# EAGLE design placa_v1 (EAGLE 7.2.0)
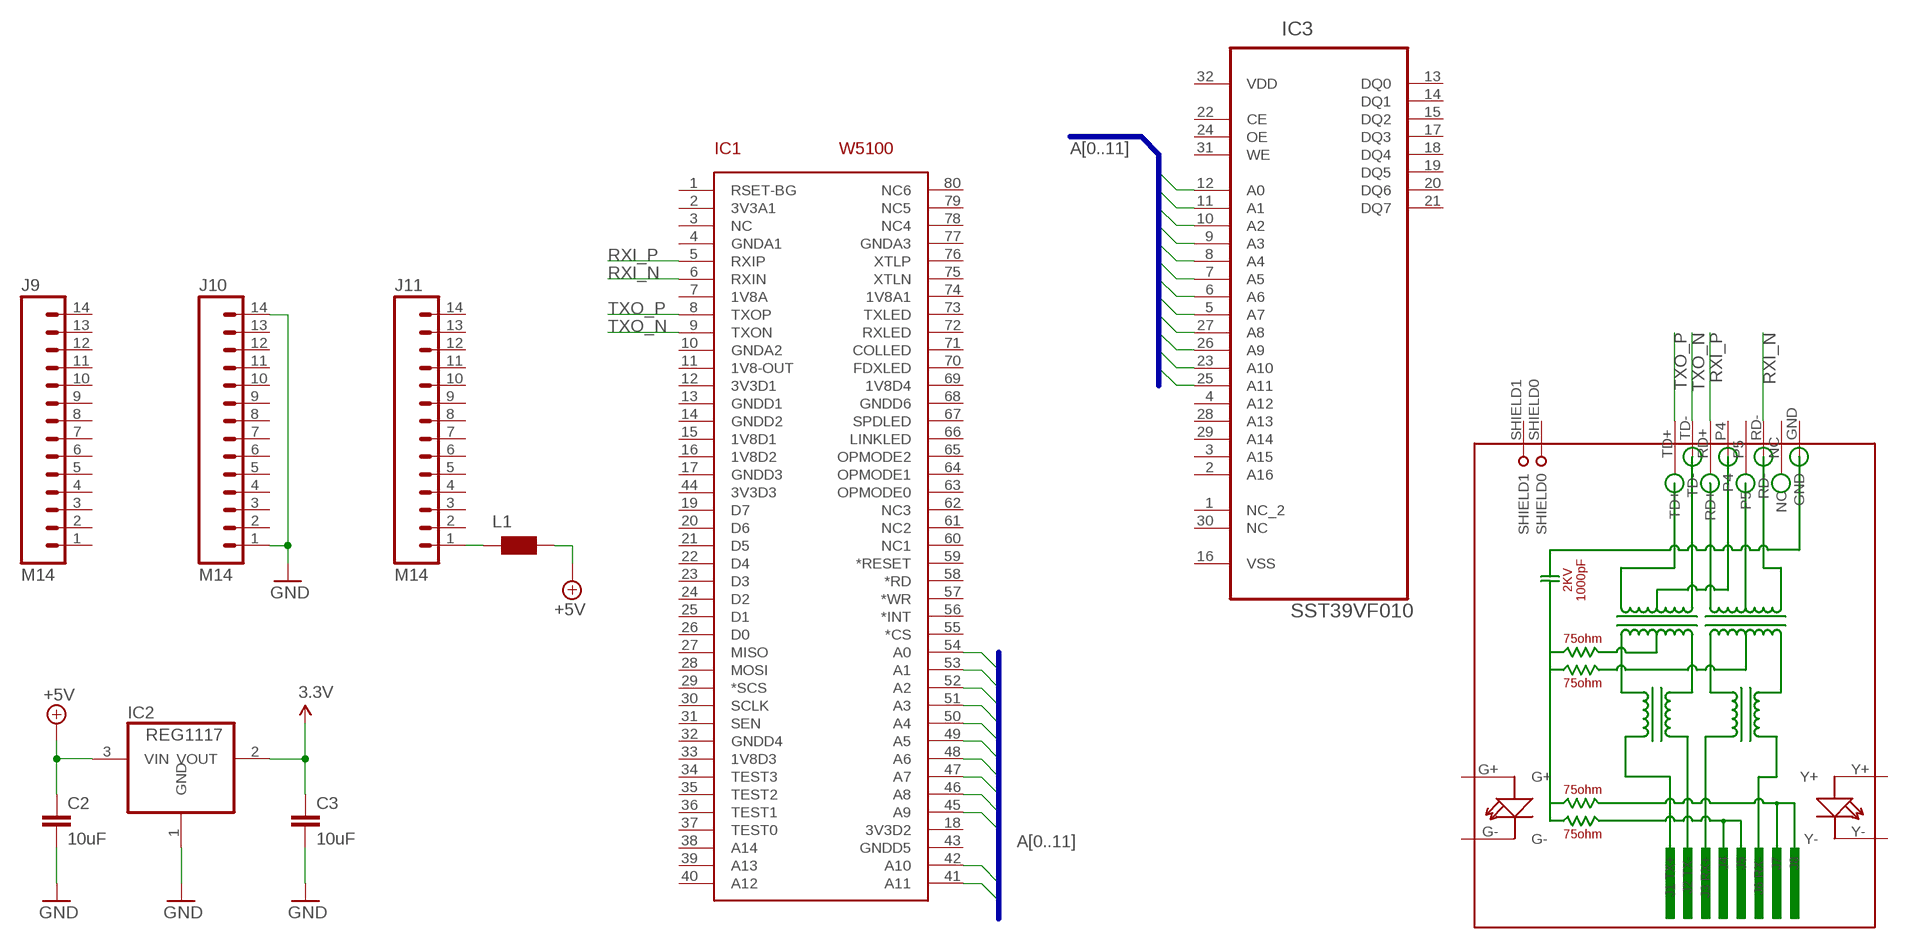
[diagram p0: schematic, sheet 1]

## Parts
C2  10uF  C-EUC0805K  [C0805K]
C3  10uF  C-EUC0805K  [C0805K]
IC1  W5100  [SQFP-S-10X10-80]
IC2  REG1117  [SOT223]
IC3  SST39VF010  SST39VF010-70-4I-NHE  [PLCC127P1244X1498X357-32N]
J9  M14  [1X14]
J10  M14  [1X14]
J11  M14  [1X14]
L1  WE-CBF_0805  [0805]
RJ1  HR911105A  [HR911105A]

## Nets
3.3V [power]: C3.1 IC2.2(VOUT)
+5V [power]: C2.1 IC2.3(VIN) L1.2
A0: IC1.54(A0) IC3.12(A0)
A1: IC1.53(A1) IC3.11(A1)
A2: IC1.52(A2) IC3.10(A2)
A3: IC1.51(A3) IC3.9(A3)
A4: IC1.50(A4) IC3.8(A4)
A5: IC1.49(A5) IC3.7(A5)
A6: IC1.48(A6) IC3.6(A6)
A7: IC1.47(A7) IC3.5(A7)
A8: IC1.46(A8) IC3.27(A8)
A9: IC1.45(A9) IC3.26(A9)
A10: IC1.42(A10) IC3.23(A10)
A11: IC1.41(A11) IC3.25(A11)
GND [power]: C2.2 C3.2 IC2.1(GND) J10.1 J10.14
N$1 [power]: J11.1 L1.1
RXI_N [rx]: IC1.6(RXIN) RJ1.RD-
RXI_P [rx]: IC1.5(RXIP) RJ1.RD+
TXO_N [tx]: IC1.9(TXON) RJ1.TD-
TXO_P [tx]: IC1.8(TXOP) RJ1.TD+
Unconnected: IC1.1(RSET-BG) IC1.3(NC) IC1.19(D7) IC1.20(D6) IC1.21(D5) IC1.22(D4) IC1.23(D3) IC1.24(D2) IC1.25(D1) IC1.26(D0) IC1.27(MISO) IC1.28(MOSI) IC1.29(*SCS) IC1.30(SCLK) IC1.31(SEN) IC1.34(TEST3) IC1.35(TEST2) IC1.36(TEST1) IC1.37(TEST0) IC1.38(A14) IC1.39(A13) IC1.40(A12) IC1.55(*CS) IC1.56(*INT) IC1.57(*WR) IC1.58(*RD) IC1.59(*RESET) IC1.60(NC1) IC1.61(NC2) IC1.62(NC3) IC1.63(OPMODE0) IC1.64(OPMODE1) IC1.65(OPMODE2) IC1.66(LINKLED) IC1.67(SPDLED) IC1.70(FDXLED) IC1.71(COLLED) IC1.72(RXLED) IC1.73(TXLED) IC1.75(XTLN) IC1.76(XTLP) IC1.78(NC4) IC1.79(NC5) IC1.80(NC6) IC3.1(NC_2) IC3.2(A16) IC3.3(A15) IC3.4(A12) IC3.13(DQ0) IC3.14(DQ1) IC3.15(DQ2) IC3.16(VSS) IC3.17(DQ3) IC3.18(DQ4) IC3.19(DQ5) IC3.20(DQ6) IC3.21(DQ7) IC3.22(CE) IC3.24(OE) IC3.28(A13) IC3.29(A14) IC3.30(NC) IC3.31(WE) J9.1 J9.2 J9.3 J9.4 J9.5 J9.6 J9.7 J9.8 J9.9 J9.10 J9.11 J9.12 J9.13 J9.14 J10.2 J10.3 J10.4 J10.5 J10.6 J10.7 J10.8 J10.9 J10.10 J10.11 J10.12 J10.13 J11.2 J11.3 J11.4 J11.5 J11.6 J11.7 J11.8 J11.9 J11.10 J11.11 J11.12 J11.13 J11.14 RJ1.G+ RJ1.G- RJ1.GND RJ1.NC RJ1.P4 RJ1.P5 RJ1.SHIELD0 RJ1.SHIELD1 RJ1.Y+ RJ1.Y-

## Buses
A[0..11]

## Power pins joined to a net without a drawn wire
1V8-OUT: IC1.11(1V8-OUT)
1V8A: IC1.7(1V8A)
1V8A1: IC1.74(1V8A1)
1V8D1: IC1.15(1V8D1)
1V8D2: IC1.16(1V8D2)
1V8D3: IC1.33(1V8D3)
1V8D4: IC1.69(1V8D4)
3V3A1: IC1.2(3V3A1)
3V3D1: IC1.12(3V3D1)
3V3D2: IC1.18(3V3D2)
3V3D3: IC1.44(3V3D3)
GNDA1: IC1.4(GNDA1)
GNDA2: IC1.10(GNDA2)
GNDA3: IC1.77(GNDA3)
GNDD1: IC1.13(GNDD1)
GNDD2: IC1.14(GNDD2)
GNDD3: IC1.17(GNDD3)
GNDD4: IC1.32(GNDD4)
GNDD5: IC1.43(GNDD5)
GNDD6: IC1.68(GNDD6)
VDD: IC3.32(VDD)

## Library data of the parts
C2 C3 = rcl:C-EU: CAPACITOR, European symbol
IC1 = wiznet_5100:W5100
IC2 = burr-brown:REG1117: 800mA and 1A Low Dropout (LDO) Positive Regulator 1.8V, 2.5V, 2.85V, 3.3V, 5V, and Adj
IC3 = sst39vf010:SST39VF010-70-4I-NHE: 1MB Flash; MPN: SST39VF010-70-4I-NHE; OC_FARNELL: 1829983; OC_NEWARK: 84R7594; PACKAGE: PLCC-32; SUPPLIER: Silicon Storage Technology
J9-J11 = SparkFun:M14: Header 14 Standard 14-pin 0.1" header. Use with straight break away headers (SKU : PRT-00116), right angle break away headers (PRT-00553), swiss pins (PRT-00743), machine pins (PRT-00117), and female headers (PRT-00115).
L1 = wuerth-elektronik:WE-CBF: SMD EMI Suppression Ferrite Beads - excellent anti-EMI properties - low DCR - impedances till 3000 ohms - rated current up to 6 A
RJ1 = magjack_hanrun_911105a:HR911105A

## Net classes
0 default: width 0.178 mm, clearance 0.178 mm
1 power: width 0.406 mm, clearance 0.203 mm to class 0, clearance 0.203 mm
2 tx: width 0.178 mm
3 rx: width 0.178 mm

## Board
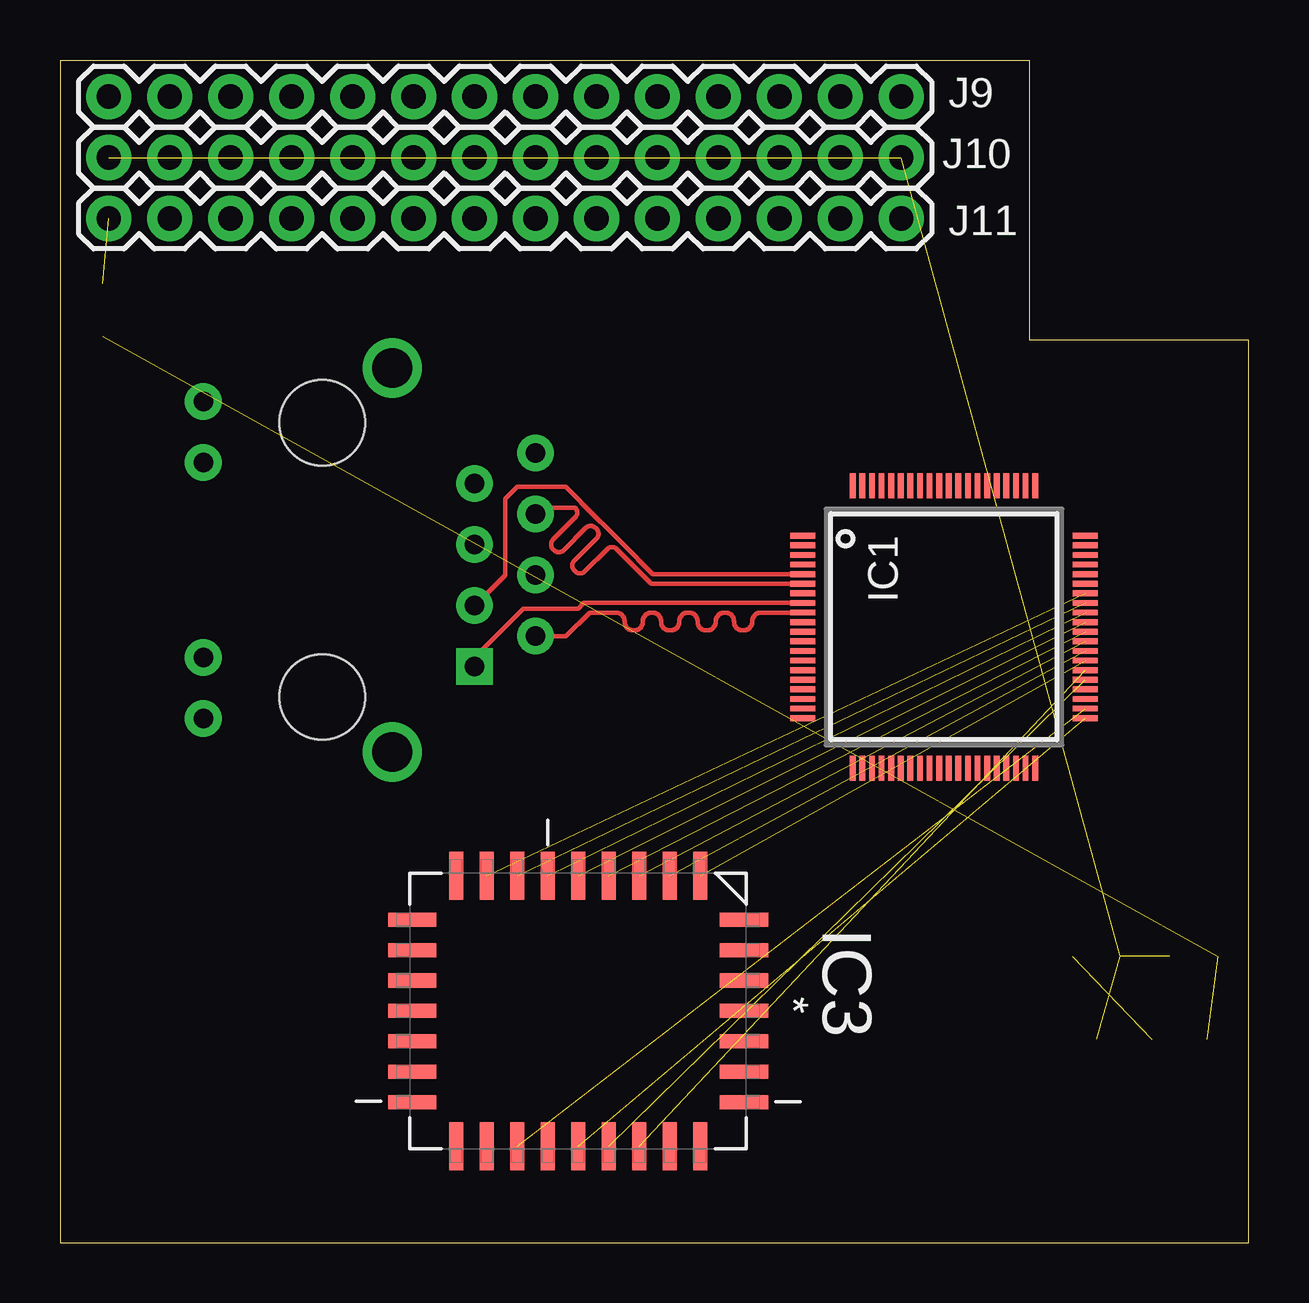
[diagram p1: board, top side]
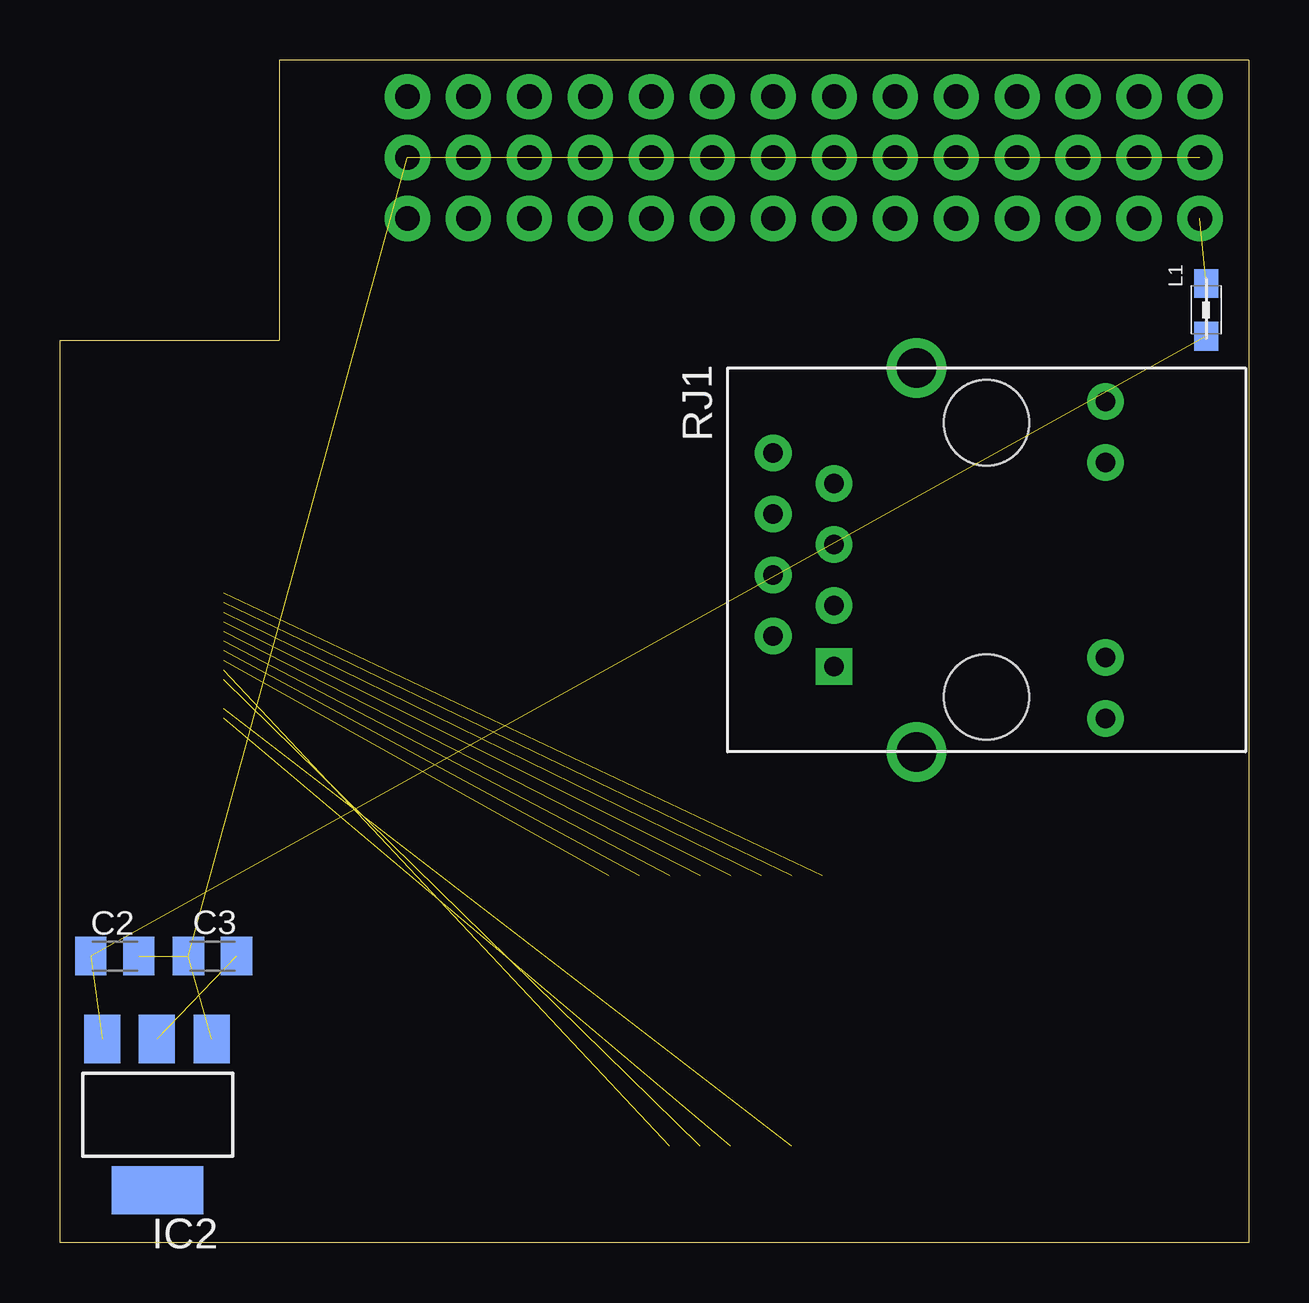
[diagram p2: board, bottom side, seen from below]

Size 49.53 x 49.28 mm. Coordinates in mm from the lower left corner, seen from the top.
Outline: 49.26,0 0,0 0,49.28 40.39,49.28 40.39,37.59 49.53,37.59 49.53,0 49.28,0
Copper layers (1*16): Top 0.035mm / dielectric 1.5mm / Bottom 0.035mm
Design rules "ITEADstudio_DRC": minimum track width 6mil, minimum drill 12mil, track to track 6mil, track to pad 6mil, pad to pad 6mil, via to via 6mil, smd to smd 0mil, copper to edge 10mil, drill to drill 10mil, minimum pad ring 10mil, minimum via ring 6mil, stop-mask expansion 2mil, vias tented up to drill 100mil, thermal gap 10mil

### Footprints (pad centres in the part's own frame; a part is rotated, then mirrored left to right if it is on the bottom)
C0805K = smd 1.3 x 1.6: 1 -1,0; 2 1,0
SQFP-S-10X10-80 = smd 0.241 x 1.041: 1 -3.8,-5.879; 2 -3.4,-5.879; 3 -3,-5.879; 4 -2.6,-5.879; 5 -2.2,-5.879; 6 -1.8,-5.879; 7 -1.4,-5.879; 8 -1,-5.879; 9 -0.6,-5.879; 10 -0.2,-5.879; 11 0.2,-5.879; 12 0.6,-5.879; 13 1,-5.879; 14 1.4,-5.879; 15 1.8,-5.879; 16 2.2,-5.879; 17 2.6,-5.879; 18 3,-5.879; 19 3.4,-5.879; 20 3.8,-5.879; 41 3.8,5.879; 42 3.4,5.879; 43 3,5.879; 44 2.6,5.879; 45 2.2,5.879; 46 1.8,5.879; 47 1.4,5.879; 48 1,5.879; 49 0.6,5.879; 50 0.2,5.879; 51 -0.2,5.879; 52 -0.6,5.879; 53 -1,5.879; 54 -1.4,5.879; 55 -1.8,5.879; 56 -2.2,5.879; 57 -2.6,5.879; 58 -3,5.879; 59 -3.4,5.879; 60 -3.8,5.879 | smd 1.041 x 0.241: 21 5.879,-3.8; 22 5.879,-3.4; 23 5.879,-3; 24 5.879,-2.6; 25 5.879,-2.2; 26 5.879,-1.8; 27 5.879,-1.4; 28 5.879,-1; 29 5.879,-0.6; 30 5.879,-0.2; 31 5.879,0.2; 32 5.879,0.6; 33 5.879,1; 34 5.879,1.4; 35 5.879,1.8; 36 5.879,2.2; 37 5.879,2.6; 38 5.879,3; 39 5.879,3.4; 40 5.879,3.8; 61 -5.879,3.8; 62 -5.879,3.4; 63 -5.879,3; 64 -5.879,2.6; 65 -5.879,2.2; 66 -5.879,1.8; 67 -5.879,1.4; 68 -5.879,1; 69 -5.879,0.6; 70 -5.879,0.2; 71 -5.879,-0.2; 72 -5.879,-0.6; 73 -5.879,-1; 74 -5.879,-1.4; 75 -5.879,-1.8; 76 -5.879,-2.2; 77 -5.879,-2.6; 78 -5.879,-3; 79 -5.879,-3.4; 80 -5.879,-3.8
SOT223 = smd 1.499 x 2.007: 1 -2.261,-3.15; 2 0.025,-3.15; 3 2.311,-3.15 | smd 3.81 x 2.007: 4 0,3.15
PLCC127P1244X1498X357-32N = smd 0.584 x 2.007: 1 0,6.909; 2 -1.27,6.909; 3 -2.54,6.909; 4 -3.81,6.909; 14 -3.81,-6.909; 15 -2.54,-6.909; 16 -1.27,-6.909; 17 0,-6.909; 18 1.27,-6.909; 19 2.54,-6.909; 20 3.81,-6.909; 30 3.81,6.909; 31 2.54,6.909; 32 1.27,6.909 | smd 2.007 x 0.584: 5 -5.639,5.08; 6 -5.639,3.81; 7 -5.639,2.54; 8 -5.639,1.27; 9 -5.639,0; 10 -5.639,-1.27; 11 -5.639,-2.54; 12 -5.639,-3.81; 13 -5.639,-5.08; 21 5.639,-5.08; 22 5.639,-3.81; 23 5.639,-2.54; 24 5.639,-1.27; 25 5.639,0; 26 5.639,1.27; 27 5.639,2.54; 28 5.639,3.81; 29 5.639,5.08
1X14 = drill 1.016 pad 1.88: 1 0,0; 2 2.54,0; 3 5.08,0; 4 7.62,0; 5 10.16,0; 6 12.7,0; 7 15.24,0; 8 17.78,0; 9 20.32,0; 10 22.86,0; 11 25.4,0; 12 27.94,0; 13 30.48,0; 14 33.02,0
0805 = smd 1.2 x 1: 1 -1.1,0; 2 1.1,0
HR911105A = drill 0.813 pad 1.524: G+ 4.953,-6.604; G- 4.953,-4.064; GND -8.89,4.445; NC -6.35,3.175; P4 -8.89,-0.635; P5 -6.35,0.635; RD+ -6.35,-1.905; RD- -8.89,1.905; TD- -8.89,-3.175; Y+ 4.953,6.604; Y- 4.953,4.064 | drill 1.651 pad 2.159: SHIELD0 -2.921,8.001; SHIELD1 -2.921,-8.001 | drill 0.813 pad 1.524 square: TD+ -6.35,-4.445 | hole 3.556: 0,-5.715; 0,5.715

### Placement (x,y rotation side)
C2  47.24,11.94 0 bottom
C3  43.18,11.94 180 bottom
IC1  36.83,25.65 270 top
IC2  45.47,5.33 180 bottom
IC3  21.59,9.65 270 top
J9  2.03,47.75 0 top
J10  2.03,45.21 0 top
J11  2.03,42.67 0 top
L1  1.78,38.86 270 bottom
RJ1  10.92,28.45 0 bottom

### Tracks (layer width: path | path; a pad name or v marks a point on that pad's centre or on a via)
3.3V  (1 unrouted)
+5V  (2 unrouted)
A0  (1 unrouted)
A1  (1 unrouted)
A2  (1 unrouted)
A3  (1 unrouted)
A4  (1 unrouted)
A5  (1 unrouted)
A6  (1 unrouted)
A7  (1 unrouted)
A8  (1 unrouted)
A9  (1 unrouted)
A10  (1 unrouted)
A11  (1 unrouted)
GND  (4 unrouted)
N$1  (1 unrouted)
RXI_N
  Top 0.178: IC1.6 24.64,27.45 23.19,28.9 arc90 22.8,28.9 21.86,27.96 arc-90 21.47,27.96 21.42,28.01 arc-90 21.42,28.41 22.36,29.34 arc90 22.36,29.73 22.31,29.78 arc90 21.91,29.78 20.98,28.85 arc-90 20.59,28.85 20.54,28.89 arc-90 20.54,29.29 21.47,30.22 arc90 21.47,30.62 20.08,30.62 RJ1.RD-
RXI_P
  Top 0.178: IC1.5 24.7,27.85 23.43,29.13 21.71,30.85 21.71,30.87 21.08,31.5 19.05,31.5 18.54,30.99 18.54,27.81 RJ1.RD+
TXO_N
  Top 0.178: IC1.9 29.21,26.25 arc90 28.84,25.89 28.84,25.87 arc-90 28.48,25.51 28.45,25.51 arc-90 28.08,25.87 28.08,25.89 arc90 27.72,26.25 27.69,26.25 arc90 27.32,25.89 27.32,25.87 arc-90 26.96,25.51 26.93,25.51 arc-90 26.56,25.87 26.56,25.89 arc90 26.2,26.25 26.17,26.25 arc90 25.8,25.89 25.8,25.87 arc-90 25.44,25.51 25.41,25.51 arc-90 25.05,25.87 25.05,25.89 arc90 24.68,26.25 24.65,26.25 arc90 24.29,25.89 24.29,25.87 arc-90 23.92,25.51 23.89,25.51 arc-90 23.52,25.87 23.52,25.89 arc90 23.16,26.25 22.82,26.25 22.06,26.25 21.08,25.27 RJ1.TD-
TXO_P
  Top 0.178: IC1.8 29.21,26.65 23.16,26.65 21.83,26.65 21.59,26.42 19.3,26.42 17.53,24.64 17.53,24.26 RJ1.TD+